# Altium schematic sheet RS485.SchDoc
size A4; SheetNumber: 6; SheetTotal: 6
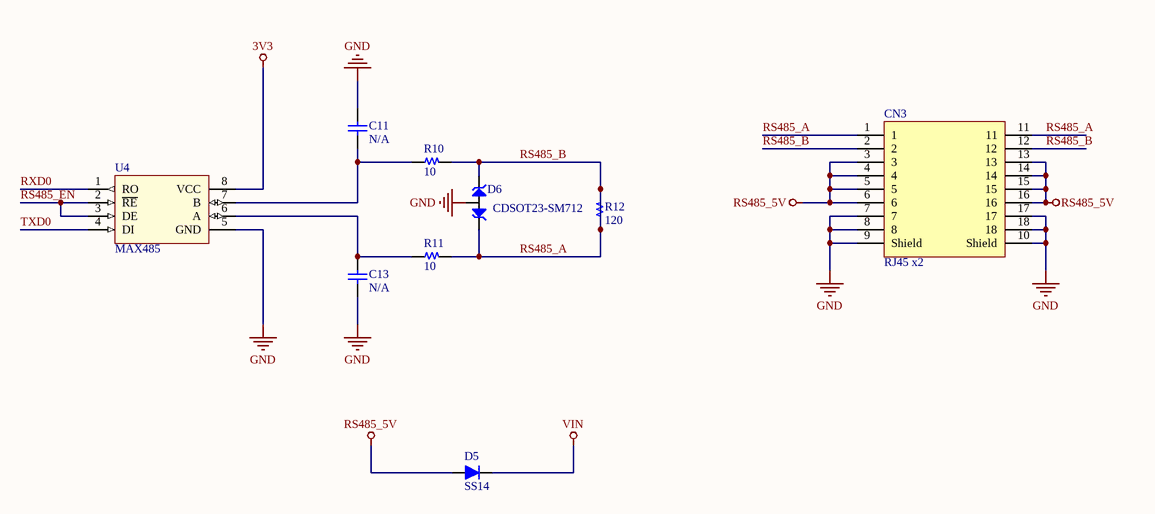
[diagram p0: RS485.SchDoc]

## Parts
C11  N/A  [C 0805]
C13  N/A  [C 0805]
CN3  RJ45 x2  [CONN/RJ45/x2]
D5  SS14  [DO-35 (SOD27 )]
D6  CDSOT23-SM712  [SOT-23]
R10  10  [R 0805]
R11  10  [R 0805]
R12  120  [R 0805]
U4  MAX485  [SOIC-8]

## Nets
3V3: U4.8(VCC)
GND: C11.1 C13.2 CN3.7 CN3.8 CN3.9(Shield) CN3.10(Shield) CN3.17 CN3.18 D6.3(COM) U4.5(GND)
RS485_5V: CN3.3 CN3.4 CN3.5 CN3.6 CN3.13 CN3.14 CN3.15 CN3.16 D5.1(A)
VIN: D5.2(K)
RS485_A: CN3.1 CN3.2 CN3.11 CN3.12 D6.1(IO1) D6.2(IO2) R10.2 R11.2 R12.1 R12.2  [also labelled RS485_B]
RS485_EN: U4.2(~{RE}) U4.3(DE)
RXD0: U4.1(RO)
TXD0: U4.4(DI)
NetC11_2: C11.2 R10.1 U4.7(B)
NetC13_1: C13.1 R11.1 U4.6(A)

## Library data of the parts
C11 C13 = Capacitor NP: Capacitor non-pol
CN3 = CON RJ45 x2: Connector RJ45 X2
D5 = Diode: Default Diode
D6 = CDSOT23-SM712: TVS DIODE 7V/12V 14V/26V SOT23-3
R10-R12 = Resistor
U4 = MAX485: Low-Power, Slew-Rate-Limited  RS-485/RS-422 Transceivers